# EAGLE schematic Motherboard (EAGLE 6.2)
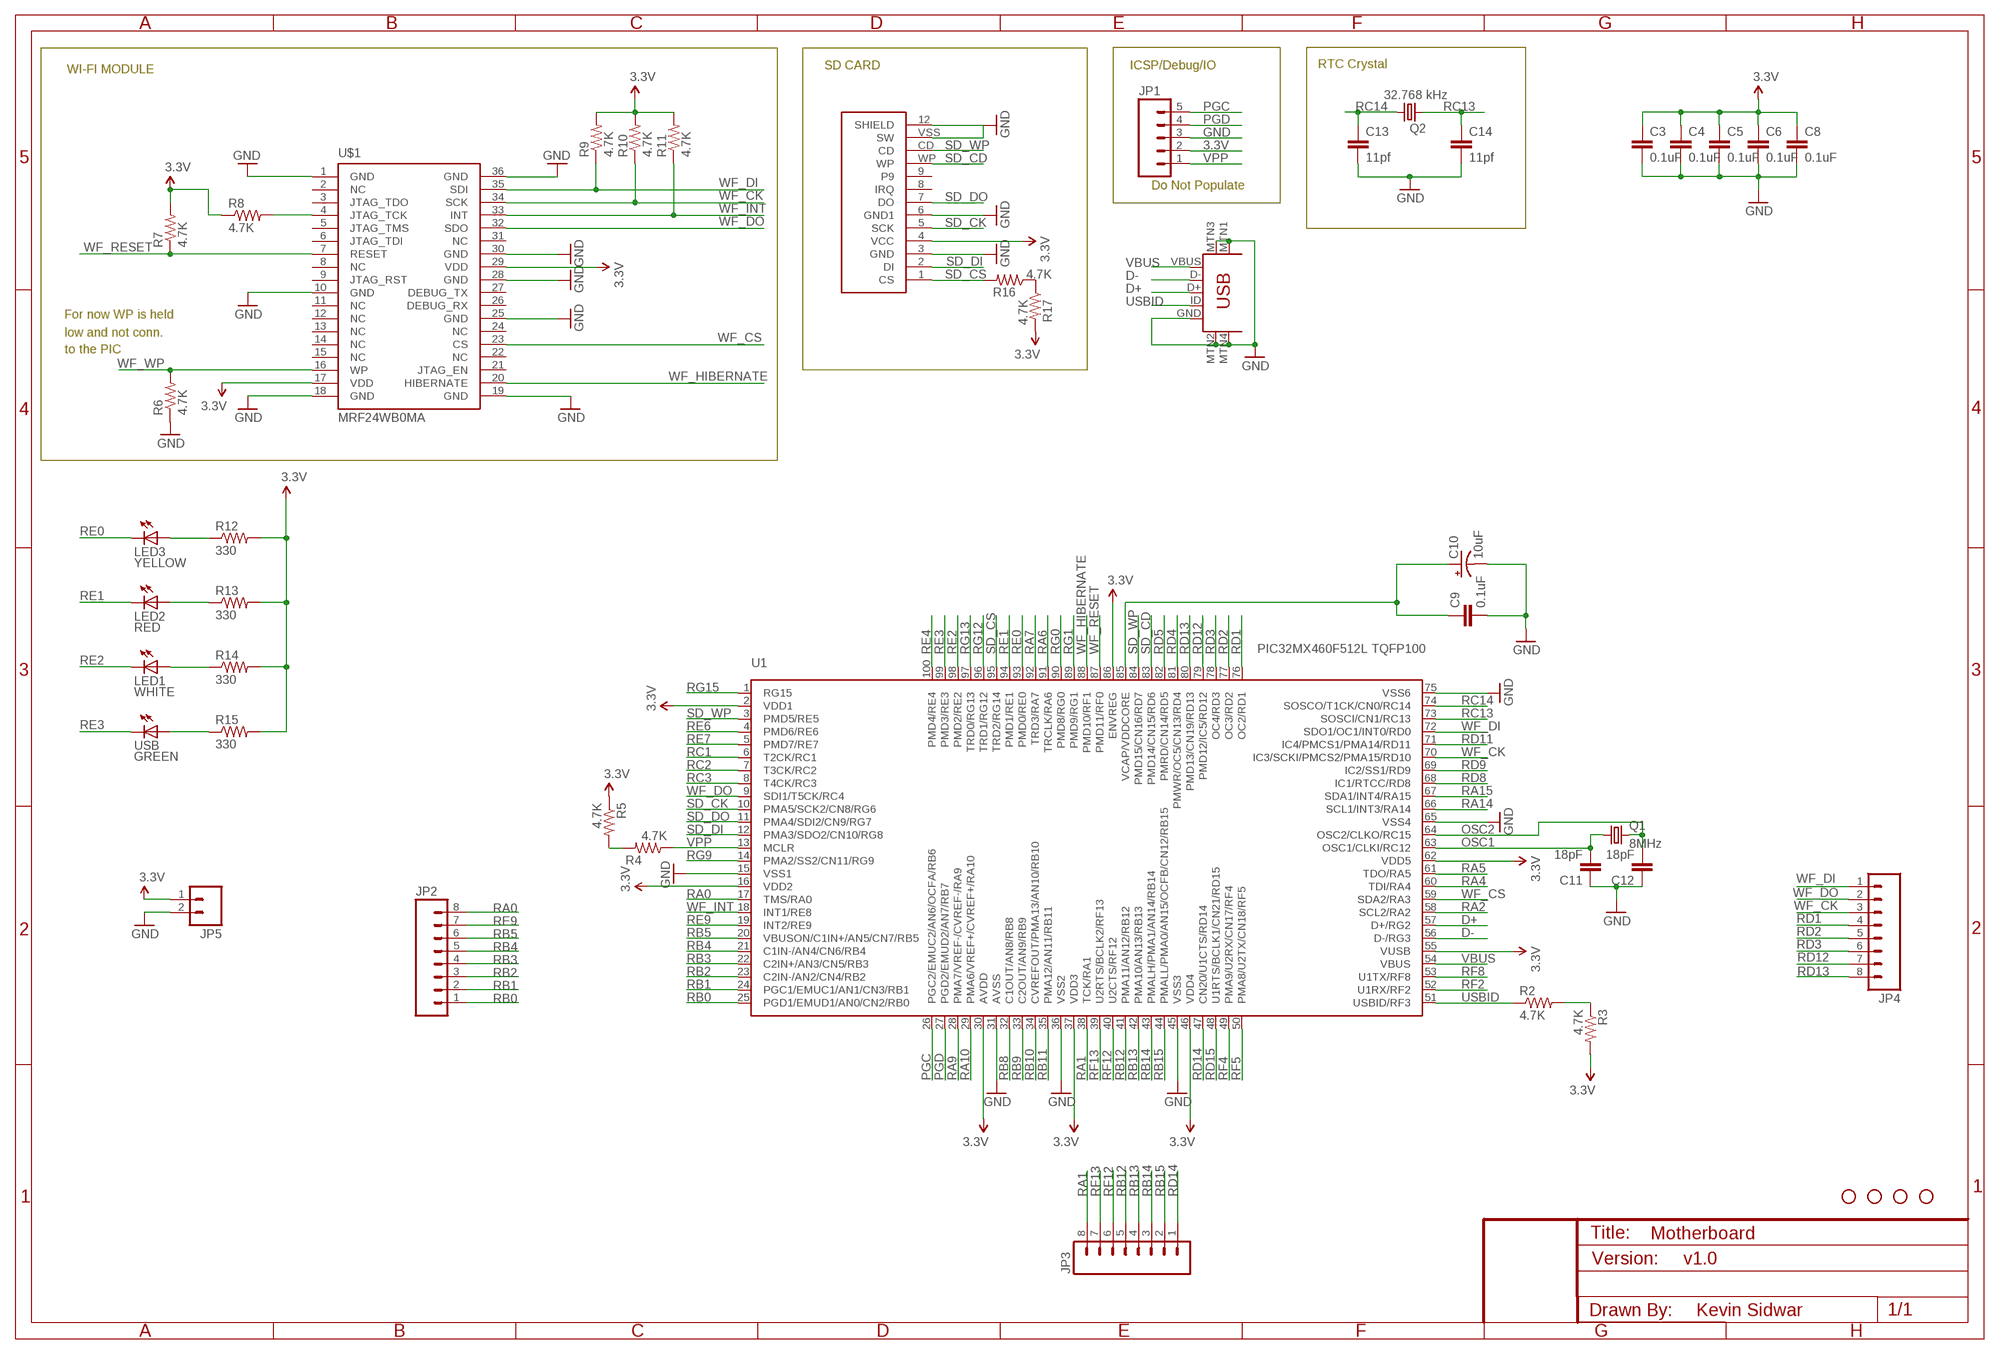
[diagram p0: schematic, sheet 1]

## Parts
C3  0.1uF  CAP0603  [0603]
C4  0.1uF  CAP0603  [0603]
C5  0.1uF  CAP0603  [0603]
C6  0.1uF  CAP0603  [0603]
C8  0.1uF  CAP0603  [0603]
C9  0.1uF  CAP0603  [0603]
C10  10uF  CAP_POL3528  [EIA3528]
C11  18pF  CAP0603  [0603]
C12  18pF  CAP0603  [0603]
C13  11pf  CAP0603  [0603]
C14  11pf  CAP0603  [0603]
JP1  M05LOCK  [1X05_LOCK]
JP2  M08LOCK  [1X08_LOCK]
JP3  M08LOCK  [1X08_LOCK]
JP4  M08LOCK  [1X08_LOCK]
JP5  M02LOCK  [1X02_LOCK]
JP6  STAND-OFF  [STAND-OFF]
JP7  STAND-OFF  [STAND-OFF]
JP8  STAND-OFF  [STAND-OFF]
JP9  STAND-OFF  [STAND-OFF]
LED1  WHITE  LED0603  [LED-0603]
LED2  RED  LED0603  [LED-0603]
LED3  YELLOW  LED0603  [LED-0603]
Q1  8MHz  CRYSTAL5X3  [CRYSTAL-SMD-5X3]
Q2  32.768 kHz  CRYSTAL  [CRYSTAL-SMD-4X2]
R2  4.7K  RESISTOR0603-RES  [0603-RES]
R3  4.7K  RESISTOR0603-RES  [0603-RES]
R4  4.7K  RESISTOR0603-RES  [0603-RES]
R5  4.7K  RESISTOR0603-RES  [0603-RES]
R6  4.7K  RESISTOR0603-RES  [0603-RES]
R7  4.7K  RESISTOR0603-RES  [0603-RES]
R8  4.7K  RESISTOR0603-RES  [0603-RES]
R9  4.7K  RESISTOR0603-RES  [0603-RES]
R10  4.7K  RESISTOR0603-RES  [0603-RES]
R11  4.7K  RESISTOR0603-RES  [0603-RES]
R12  330  RESISTOR0603-RES  [0603-RES]
R13  330  RESISTOR0603-RES  [0603-RES]
R14  330  RESISTOR0603-RES  [0603-RES]
R15  330  RESISTOR0603-RES  [0603-RES]
R16  4.7K  RESISTOR0603-RES  [0603-RES]
R17  4.7K  RESISTOR0603-RES  [0603-RES]
U1  PIC32MX460F512L TQFP100  PIC32MX4XXLTQFP100  [TQFP100]
U$1  MRF24WB0MA  [SMD_MRF]
U$2  SD_CARD_SOCKETALPS  [SD_ALPS]
U$21  USB-MINIB-5PIN  [USB-MINIB]
USB  GREEN  LED0603  [LED-0603]

## Nets
3.3V: C3.1 C4.1 C5.1 C6.1 C8.1 JP1.2 JP5.1 R3.2 R5.1 R7.2 R8.1 R9.2 R10.2 R11.2 R12.2 R13.2 R14.2 R15.2 R17.2 U1.2(VDD1) U1.16(VDD2) U1.30(AVDD) U1.37(VDD3) U1.46(VDD4) U1.55(VUSB) U1.62(VDD5) U1.86(ENVREG) U$1.17(VDD) U$1.29(VDD) U$2.4(VCC)
D+: U1.57(D+/RG2) U$21.D+
D-: U1.56(D-/RG3) U$21.D-
GND: C3.2 C4.2 C5.2 C6.2 C8.2 C9.2 C10.C(-) C11.1 C12.1 C13.2 C14.2 JP1.3 JP5.2 R6.1 U1.15(VSS1) U1.31(AVSS) U1.36(VSS2) U1.45(VSS3) U1.65(VSS4) U1.75(VSS6) U$1.1(GND) U$1.10(GND) U$1.18(GND) U$1.19(GND) U$1.25(GND) U$1.28(GND) U$1.30(GND) U$1.36(GND) U$2.3(GND) U$2.6(GND1) U$2.12(SHIELD) U$2.VSS(SW) U$21.GND U$21.MTN1(MTN2) U$21.MTN2(MTN3) U$21.MTN3(MTN1) U$21.MTN4
N$5: R8.2 U$1.4(JTAG_TCK)
N$10: R16.1 R17.1
N$11: R4.2 R5.2
N$15: R2.2 R3.1
N$20: R15.1 USB.A
N$22: LED1.A R14.1
N$23: LED2.A R13.1
N$35: LED3.A R12.1
N$110: C9.1 C10.A(+) U1.85(VCAP/VDDCORE)
OSC1: C11.2 Q1.1 U1.63(OSC1/CLKI/RC12)
OSC2: C12.2 Q1.3 U1.64(OSC2/CLKO/RC15)
PGC: JP1.5 U1.26(PGC2/EMUC2/AN6/OCFA/RB6)
PGD: JP1.4 U1.27(PGD2/EMUD2/AN7/RB7)
RA0: JP2.8 U1.17(TMS/RA0)
RA1: JP3.8 U1.38(TCK/RA1)
RA2: U1.58(SCL2/RA2)
RA4: U1.60(TDI/RA4)
RA5: U1.61(TDO/RA5)
RA6: U1.91(TRCLK/RA6)
RA7: U1.92(TRD3/RA7)
RA9: U1.28(PMA7/VREF-/CVREF-/RA9)
RA10: U1.29(PMA6/VREF+/CVREF+/RA10)
RA14: U1.66(SCL1/INT3/RA14)
RA15: U1.67(SDA1/INT4/RA15)
RB0: JP2.1 U1.25(PGD1/EMUD1/AN0/CN2/RB0)
RB1: JP2.2 U1.24(PGC1/EMUC1/AN1/CN3/RB1)
RB2: JP2.3 U1.23(C2IN-/AN2/CN4/RB2)
RB3: JP2.4 U1.22(C2IN+/AN3/CN5/RB3)
RB4: JP2.5 U1.21(C1IN-/AN4/CN6/RB4)
RB5: JP2.6 U1.20(VBUSON/C1IN+/AN5/CN7/RB5)
RB8: U1.32(C1OUT/AN8/RB8)
RB9: U1.33(C2OUT/AN9/RB9)
RB10: U1.34(CVREFOUT/PMA13/AN10/RB10)
RB11: U1.35(PMA12/AN11/RB11)
RB12: JP3.5 U1.41(PMA11/AN12/RB12)
RB13: JP3.4 U1.42(PMA10/AN13/RB13)
RB14: JP3.3 U1.43(PMALH/PMA1/AN14/RB14)
RB15: JP3.2 U1.44(PMALL/PMA0/AN15/OCFB/CN12/RB15)
RC1: U1.6(T2CK/RC1)
RC2: U1.7(T3CK/RC2)
RC3: U1.8(T4CK/RC3)
RC13: C14.1 Q2.P$2 U1.73(SOSCI/CN1/RC13)
RC14: C13.1 Q2.P$1 U1.74(SOSCO/T1CK/CN0/RC14)
RD1: JP4.4 U1.76(OC2/RD1)
RD2: JP4.5 U1.77(OC3/RD2)
RD3: JP4.6 U1.78(OC4/RD3)
RD4: U1.81(PMWR/OC5/CN13/RD4)
RD5: U1.82(PMRD/CN14/RD5)
RD8: U1.68(IC1/RTCC/RD8)
RD9: U1.69(IC2/SS1/RD9)
RD11: U1.71(IC4/PMCS1/PMA14/RD11)
RD12: JP4.7 U1.79(PMD12/IC5/RD12)
RD13: JP4.8 U1.80(PMD13/CN19/RD13)
RD14: JP3.1 U1.47(CN20/U1CTS/RD14)
RD15: U1.48(U1RTS/BCLK1/CN21/RD15)
RE0: LED3.C U1.93(PMD0/RE0)
RE1: LED2.C U1.94(PMD1/RE1)
RE2: LED1.C U1.98(PMD2/RE2)
RE3: U1.99(PMD3/RE3) USB.C
RE4: U1.100(PMD4/RE4)
RE6: U1.4(PMD6/RE6)
RE7: U1.5(PMD7/RE7)
RE9: JP2.7 U1.19(INT2/RE9)
RF2: U1.52(U1RX/RF2)
RF4: U1.49(PMA9/U2RX/CN17/RF4)
RF5: U1.50(PMA8/U2TX/CN18/RF5)
RF8: U1.53(U1TX/RF8)
RF12: JP3.6 U1.40(U2CTS/RF12)
RF13: JP3.7 U1.39(U2RTS/BCLK2/RF13)
RG0: U1.90(PMD8/RG0)
RG1: U1.89(PMD9/RG1)
RG9: U1.14(PMA2/SS2/CN11/RG9)
RG12: U1.96(TRD1/RG12)
RG13: U1.97(TRD0/RG13)
RG15: U1.1(RG15)
SD_CD: U1.83(PMD14/CN15/RD6) U$2.WP
SD_CK: U1.10(PMA5/SCK2/CN8/RG6) U$2.5(SCK)
SD_CS: R16.2 U1.95(TRD2/RG14) U$2.1(CS)
SD_DI: U1.12(PMA3/SDO2/CN10/RG8) U$2.2(DI)
SD_DO: U1.11(PMA4/SDI2/CN9/RG7) U$2.7(DO)
SD_WP: U1.3(PMD5/RE5) U1.84(PMD15/CN16/RD7) U$2.CD
USBID: R2.1 U1.51(USBID/RF3) U$21.ID
VBUS: U1.54(VBUS) U$21.VBUS
VPP: JP1.1 R4.1 U1.13(MCLR)
WF_CK: JP4.3 R10.1 U1.70(IC3/SCKI/PMCS2/PMA15/RD10) U$1.34(SCK)
WF_CS: U1.59(SDA2/RA3) U$1.23(CS)
WF_DI: JP4.1 R9.1 U1.72(SDO1/OC1/INT0/RD0) U$1.35(SDI)
WF_DO: JP4.2 U1.9(SDI1/T5CK/RC4) U$1.32(SDO)
WF_HIBERNATE: U1.88(PMD10/RF1) U$1.20(HIBERNATE)
WF_INT: R11.1 U1.18(INT1/RE8) U$1.33(INT)
WF_RESET: R7.1 U1.87(PMD11/RF0) U$1.7(RESET)
WF_WP: R6.2 U$1.16(WP)
Unconnected: U$1.2(NC) U$1.3(JTAG_TDO) U$1.5(JTAG_TMS) U$1.6(JTAG_TDI) U$1.8(NC) U$1.9(JTAG_RST) U$1.11(NC) U$1.12(NC) U$1.13(NC) U$1.14(NC) U$1.15(NC) U$1.21(JTAG_EN) U$1.22(NC) U$1.24(NC) U$1.26(DEBUG_RX) U$1.27(DEBUG_TX) U$1.31(NC) U$2.8(IRQ) U$2.9

## Notes on the sheet
- SD CARD | ICSP/Debug/IO
- RTC Crystal
- WI-FI MODULE
- Do Not Populate
- For now WP is held
- low and not conn.
- to the PIC
- v1.0
- Kevin Sidwar

## Library data of the parts
C3-C6 C8 C9 C11-C14 = SparkFun:CAP: Capacitor Standard 0603 ceramic capacitor, and 0.1" leaded capacitor.
C10 = SparkFun02-20-08:CAP_POL: Capacitor Polarized These are standard SMD and PTH capacitors. Normally 10uF, 47uF, and 100uF in electrolytic and tantalum varieties. Always verify the external diameter of the through hole cap, it varies with capacity, voltage, and manufacturer. The EIA devices should be standard.
JP1 = SparkFun-Connectors:M05: Header 5 Standard 5-pin 0.1" header. Use with straight break away headers (SKU : PRT-00116), right angle break away headers (PRT-00553), swiss pins (PRT-00743), machine pins (PRT-00117), and female headers (PRT-00115). Molex polarized connector foot print use with SKU : PRT-08230 with associated crimp pins and housings.
JP2-JP4 = SparkFun-Connectors:M08: Header 8 Standard 8-pin 0.1" header. Use with straight break away headers (SKU : PRT-00116), right angle break away headers (PRT-00553), swiss pins (PRT-00743), machine pins (PRT-00117), and female headers (PRT-00115).
JP5 = SparkFun-Connectors:M02: Header 2 Standard 2-pin 0.1" header. Use with straight break away headers (SKU : PRT-00116), right angle break away headers (PRT-00553), swiss pins (PRT-00743), machine pins (PRT-00117), and female headers (PRT-00115). Molex polarized connector foot print use with SKU : PRT-08233 with associated crimp pins and housings.
JP6-JP9 = lizardworx:STAND-OFF: #4 Stand Off This is the mechanical footprint for a #4 phillips button head screw. Use the keepout ring to avoid running the screw head into surrounding components. SKU : PRT-00447
LED1-LED3 USB = SparkFun:LED: LEDs Standard schematic elements and footprints for 5mm, 3mm, 1206, and 0603 sized LEDs. 5mm - Spark Fun Electronics SKU : COM-00529 (and others)
Q1 = SparkFun11_03_09:CRYSTAL: Crystals Various standard crystals. Proven footprints. Spark Fun Electronics SKU : COM-00534
Q2 = lizardworx:CRYSTAL: Various standard crystals. Proven footprints. Spark Fun Electronics SKU : COM-00534
R2-R17 = SparkFun-Passives:RESISTOR: Resistor Basic schematic elements and footprints for 0603, 1206, and PTH resistors.
U1 = SchmalzHaus:PIC32MX4XXL
U$1 = lizardworx:MRF24WB0MA
U$2 = lizardworx:SD_CARD_SOCKET: SD/MMC Socket Media socket for SD and MMC cards. Push-push type. Schematic element and footprint production proven. Spark Fun Electronics SKU : PRT-00136
U$21 = SparkFun-Connectors:USB-MINIB: Mini-USB "B" connector with 5th pin broken out. Created new symbol breaking out 5th "ID" pin in mini/micro USB connector spec. See: http://en.wikipedia.org/wiki/Mini_usb#Cables. Uses same footprint as 4-pin symbol. Also added pins to connect to mounting / shield pads if required (probably not generally needed as signals aren't shielded once they leave the connector).